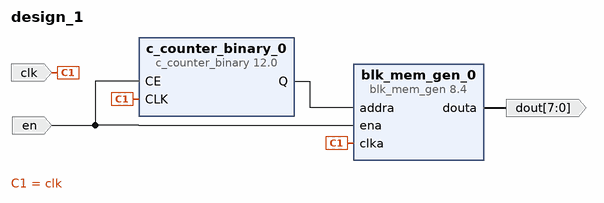
[diagram p0: block diagram of the top level]
# Vivado block design design_1, xc7a100tcsg324-1, Vivado 2023.2
create_bd_design design_1

create_bd_port -dir I -type clk clk
set_property -dict {CONFIG.FREQ_HZ 10000000} [get_bd_ports clk]
create_bd_port -dir I en
create_bd_port -dir O -from 7 -to 0 dout

create_bd_cell -type ip -vlnv xilinx.com:ip:blk_mem_gen:8.4 blk_mem_gen_0
set_property -dict [list \
  CONFIG.Coe_File {../../../../../../../../Users/Joules Soldevilla/Downloads/data.coe} \
  CONFIG.Load_Init_File true \
  CONFIG.Memory_Type Single_Port_ROM \
  CONFIG.Write_Depth_A 1024 \
  CONFIG.Write_Width_A 8 \
  CONFIG.use_bram_block Stand_Alone \
] [get_bd_cells blk_mem_gen_0]
create_bd_cell -type ip -vlnv xilinx.com:ip:c_counter_binary:12.0 c_counter_binary_0
set_property -dict {CONFIG.CE true CONFIG.Output_Width 10} [get_bd_cells c_counter_binary_0]

# ---- connections ----

connect_bd_net -net CLK_0_1 [get_bd_ports clk] [get_bd_pins c_counter_binary_0/CLK] [get_bd_pins blk_mem_gen_0/clka]
connect_bd_net [get_bd_pins blk_mem_gen_0/douta] [get_bd_ports dout]
connect_bd_net [get_bd_pins c_counter_binary_0/Q] [get_bd_pins blk_mem_gen_0/addra]
connect_bd_net -net ena_0_1 [get_bd_ports en] [get_bd_pins blk_mem_gen_0/ena] [get_bd_pins c_counter_binary_0/CE]

validate_bd_design
save_bd_design
